# EAGLE design board (EAGLE 9.5.2)
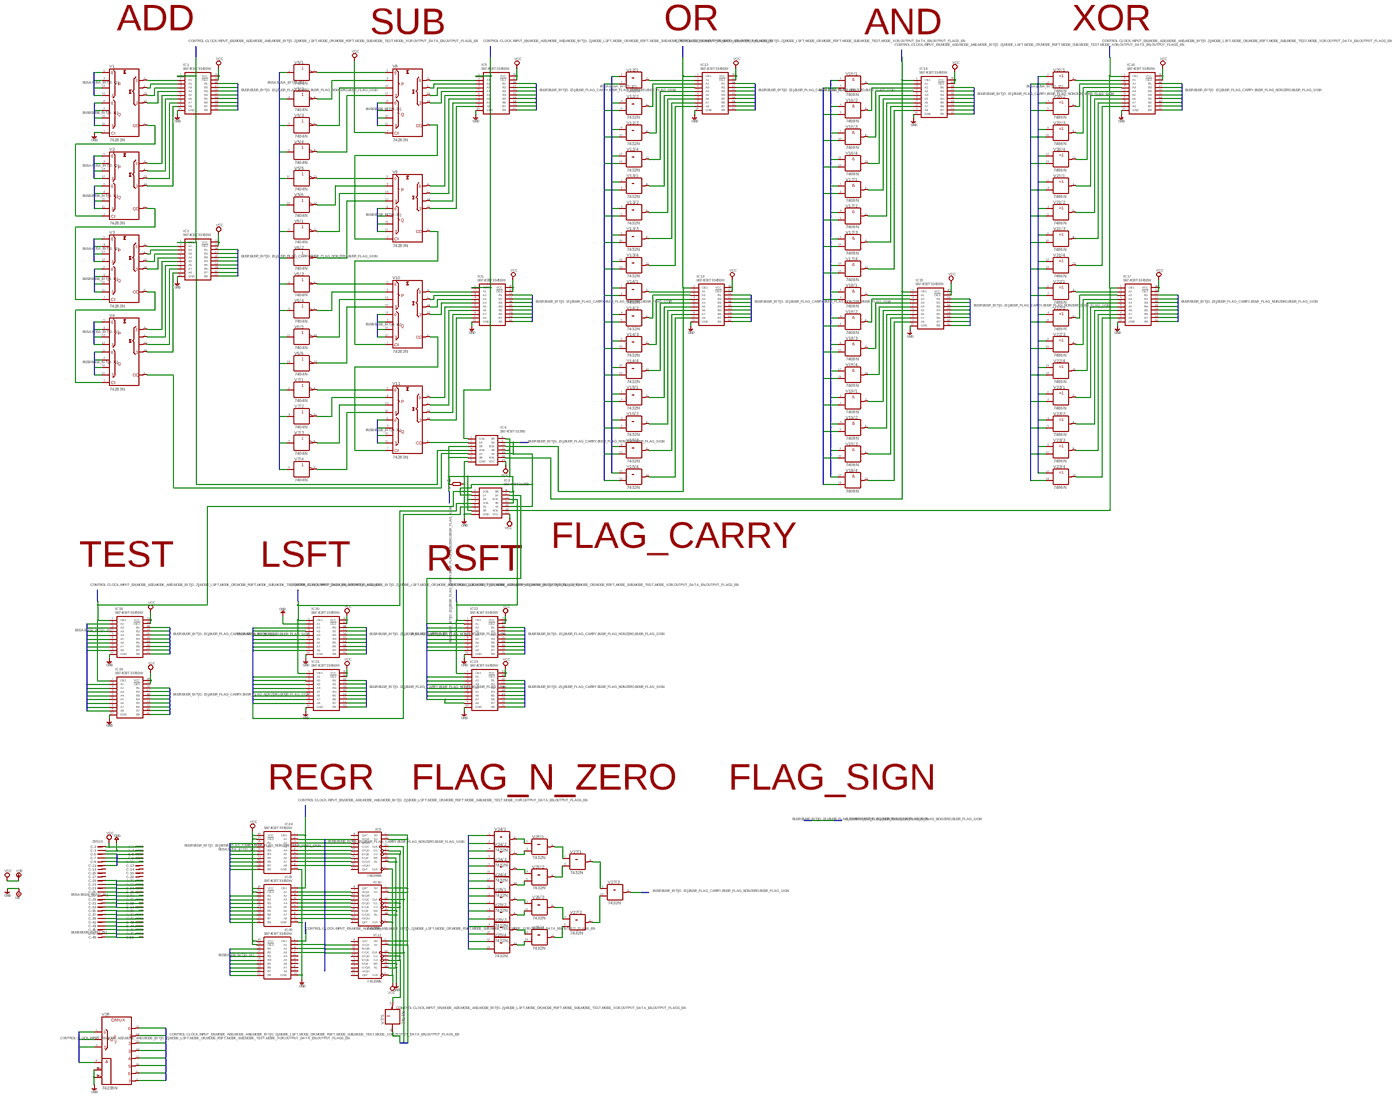
[diagram p0: schematic, sheet 1, overview]
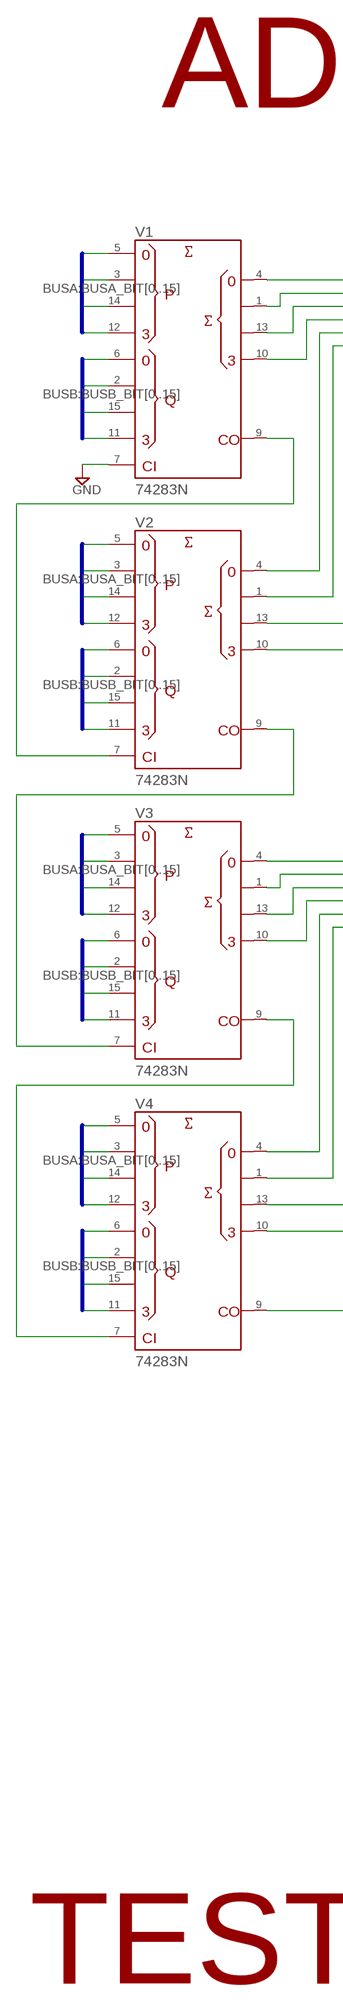
[diagram p1: schematic, sheet 1, part 1 of 6]
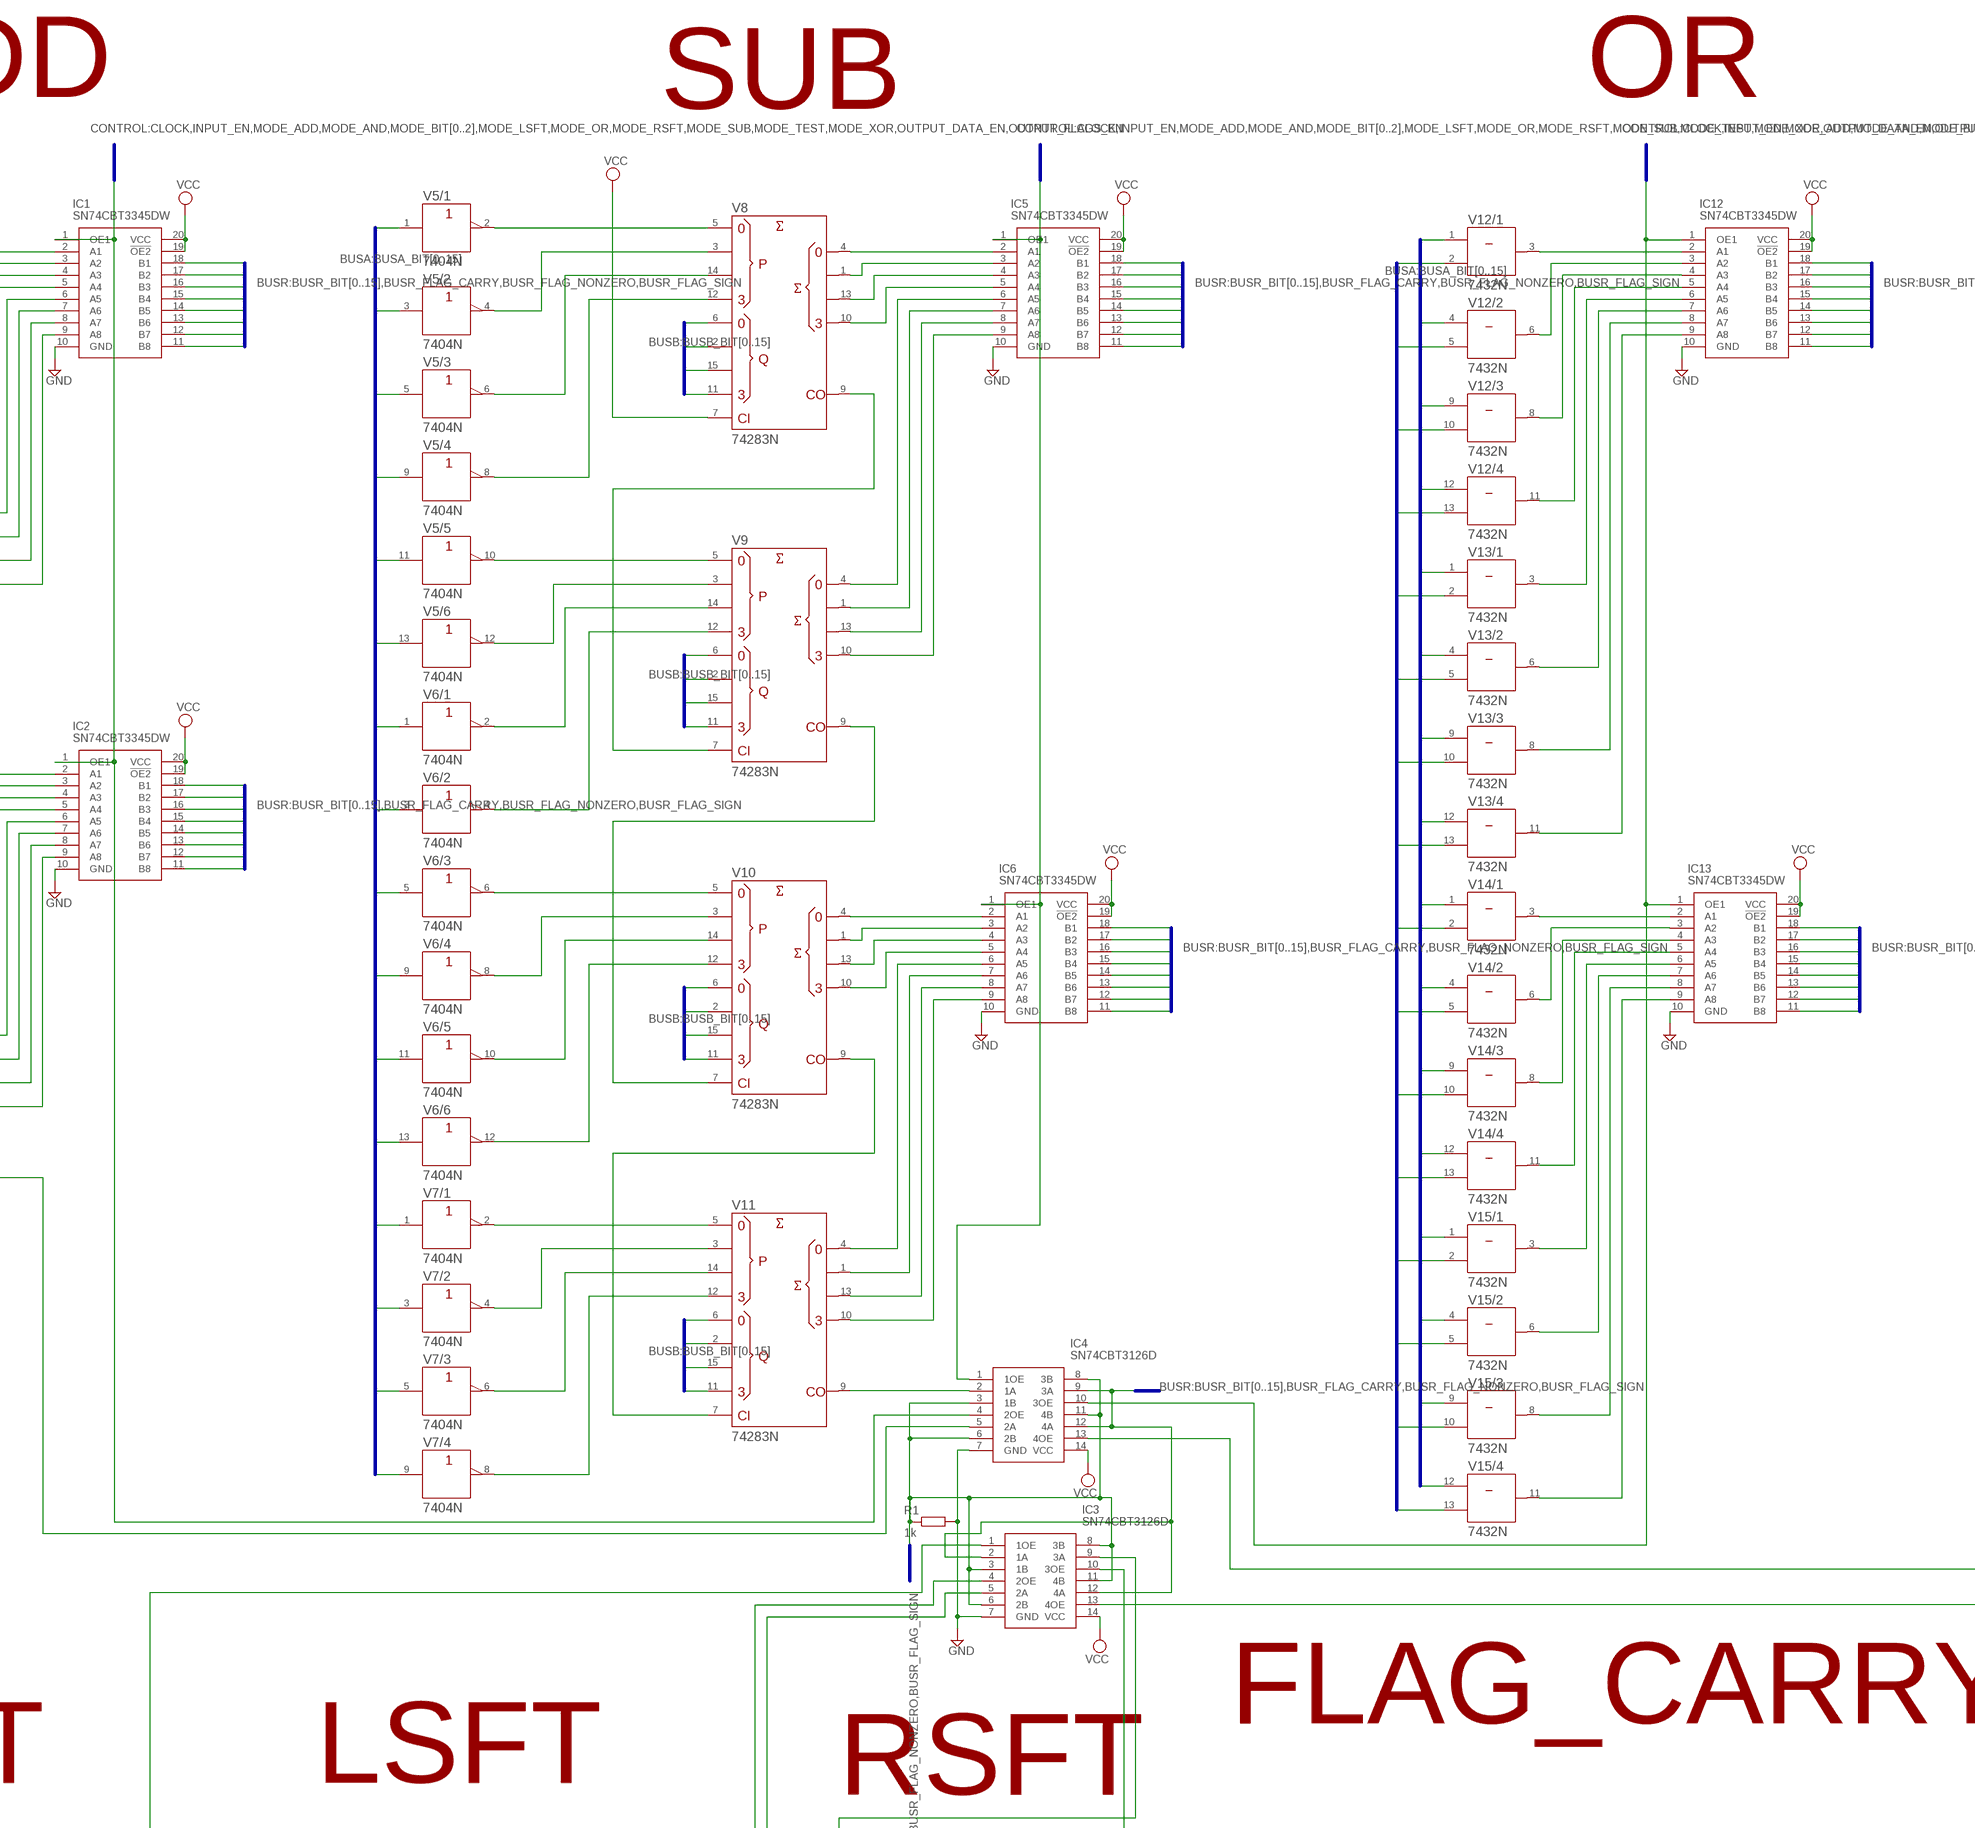
[diagram p2: schematic, sheet 1, part 2 of 6]
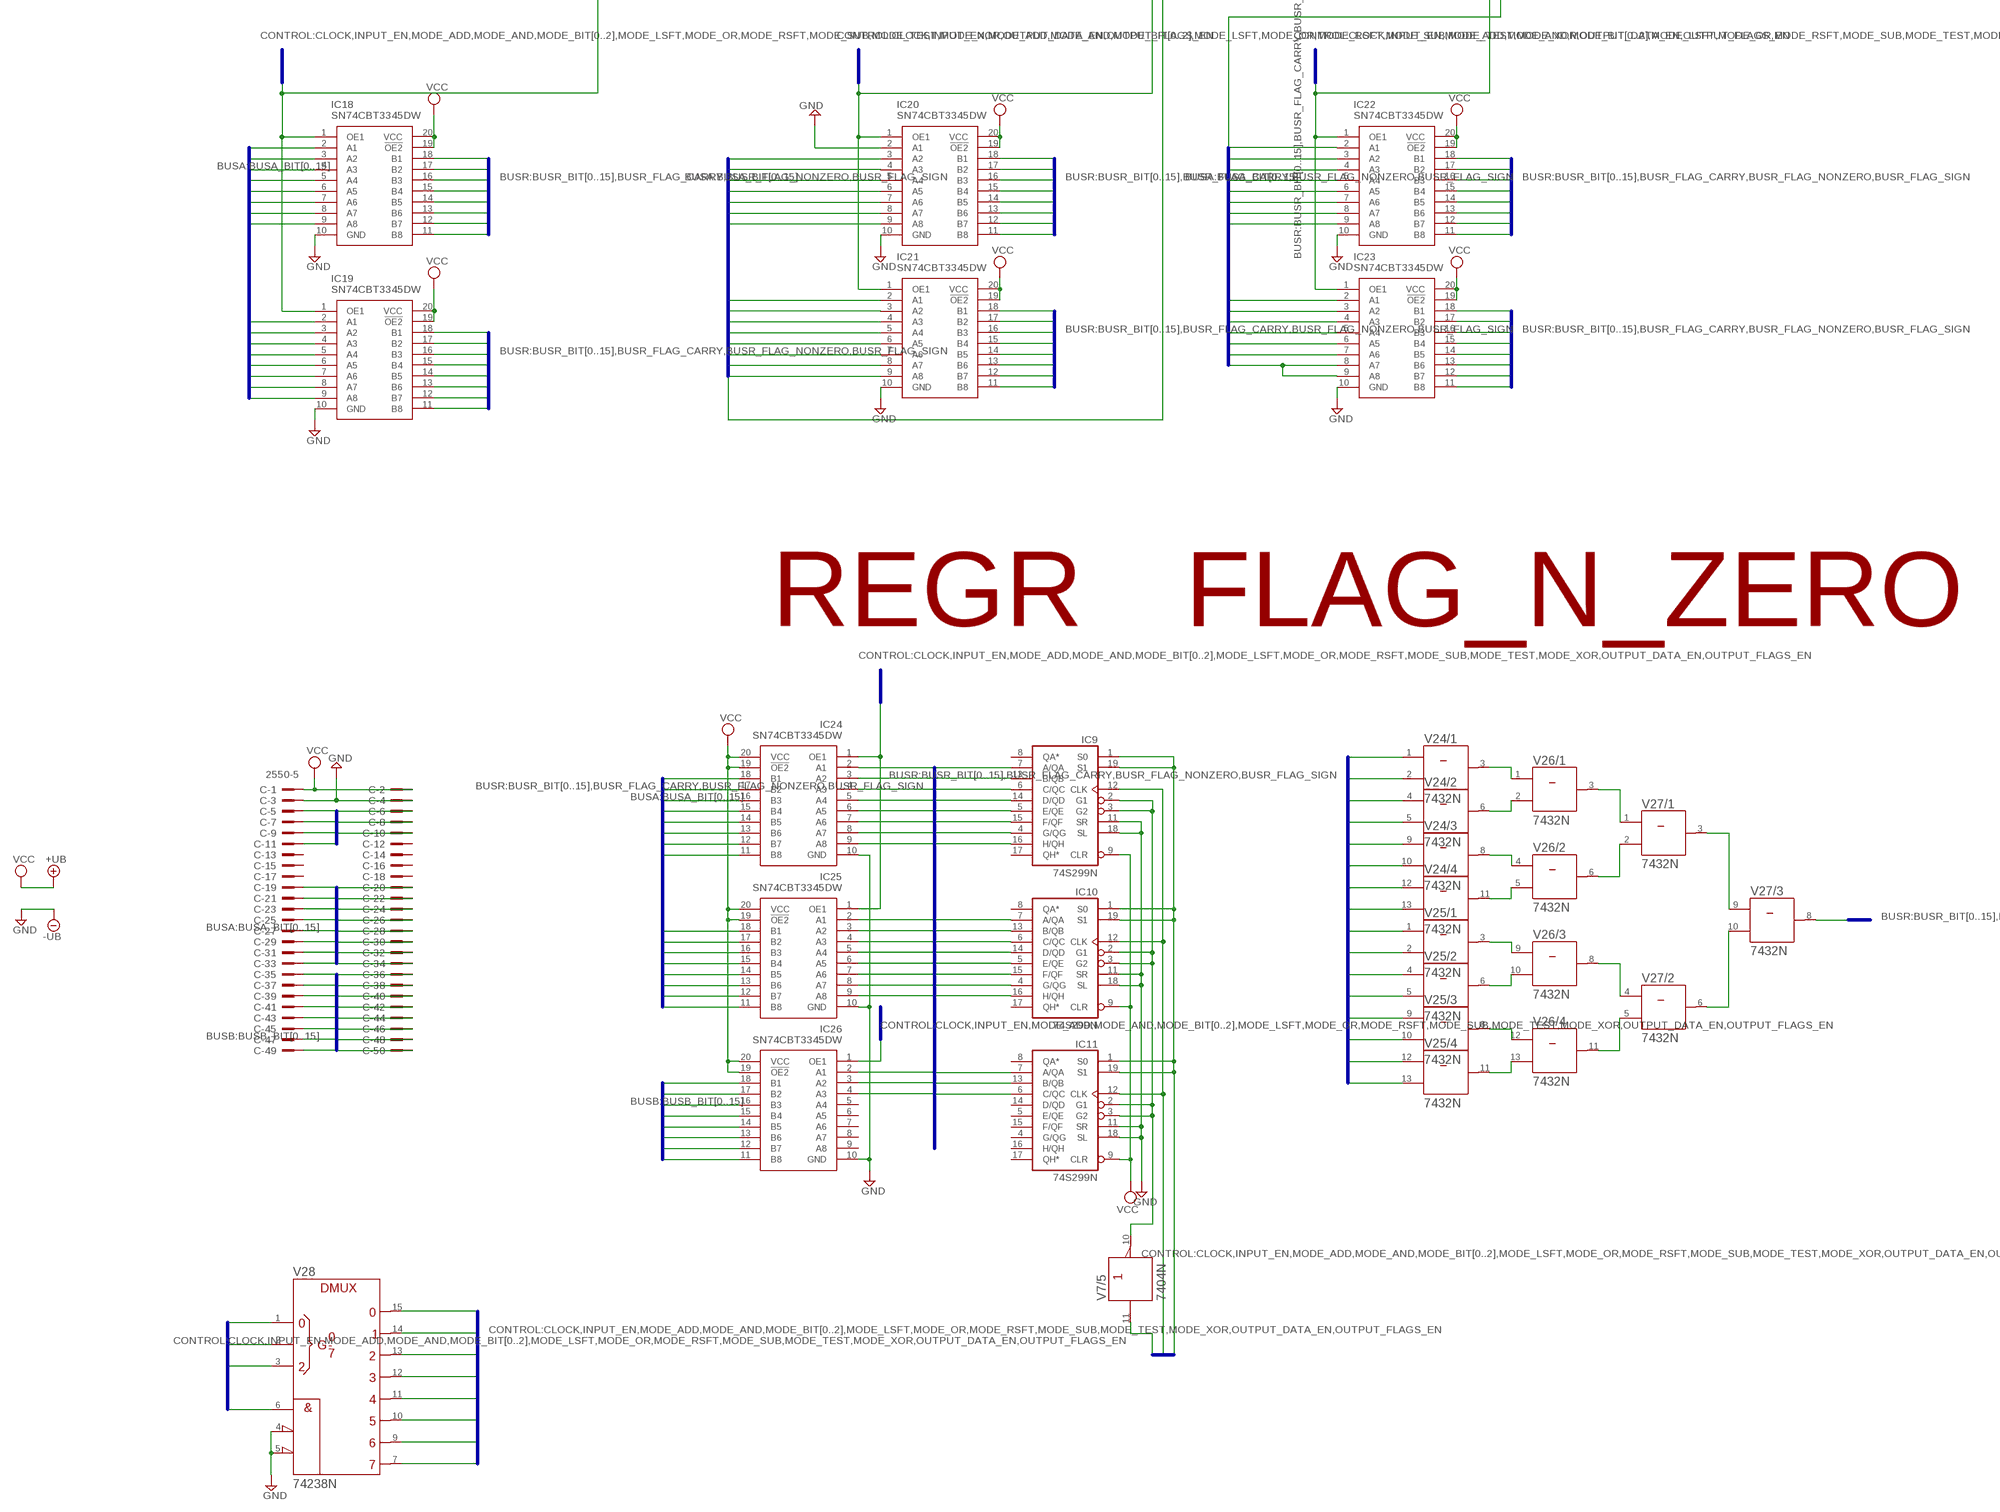
[diagram p3: schematic, sheet 1, part 3 of 6]
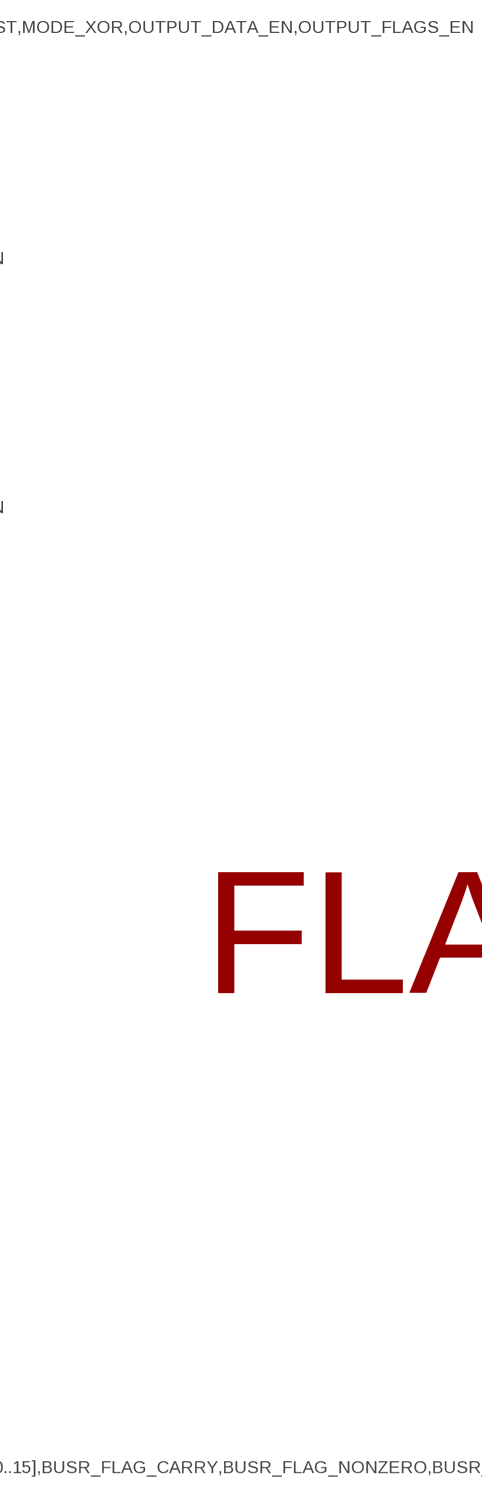
[diagram p4: schematic, sheet 1, part 4 of 6]
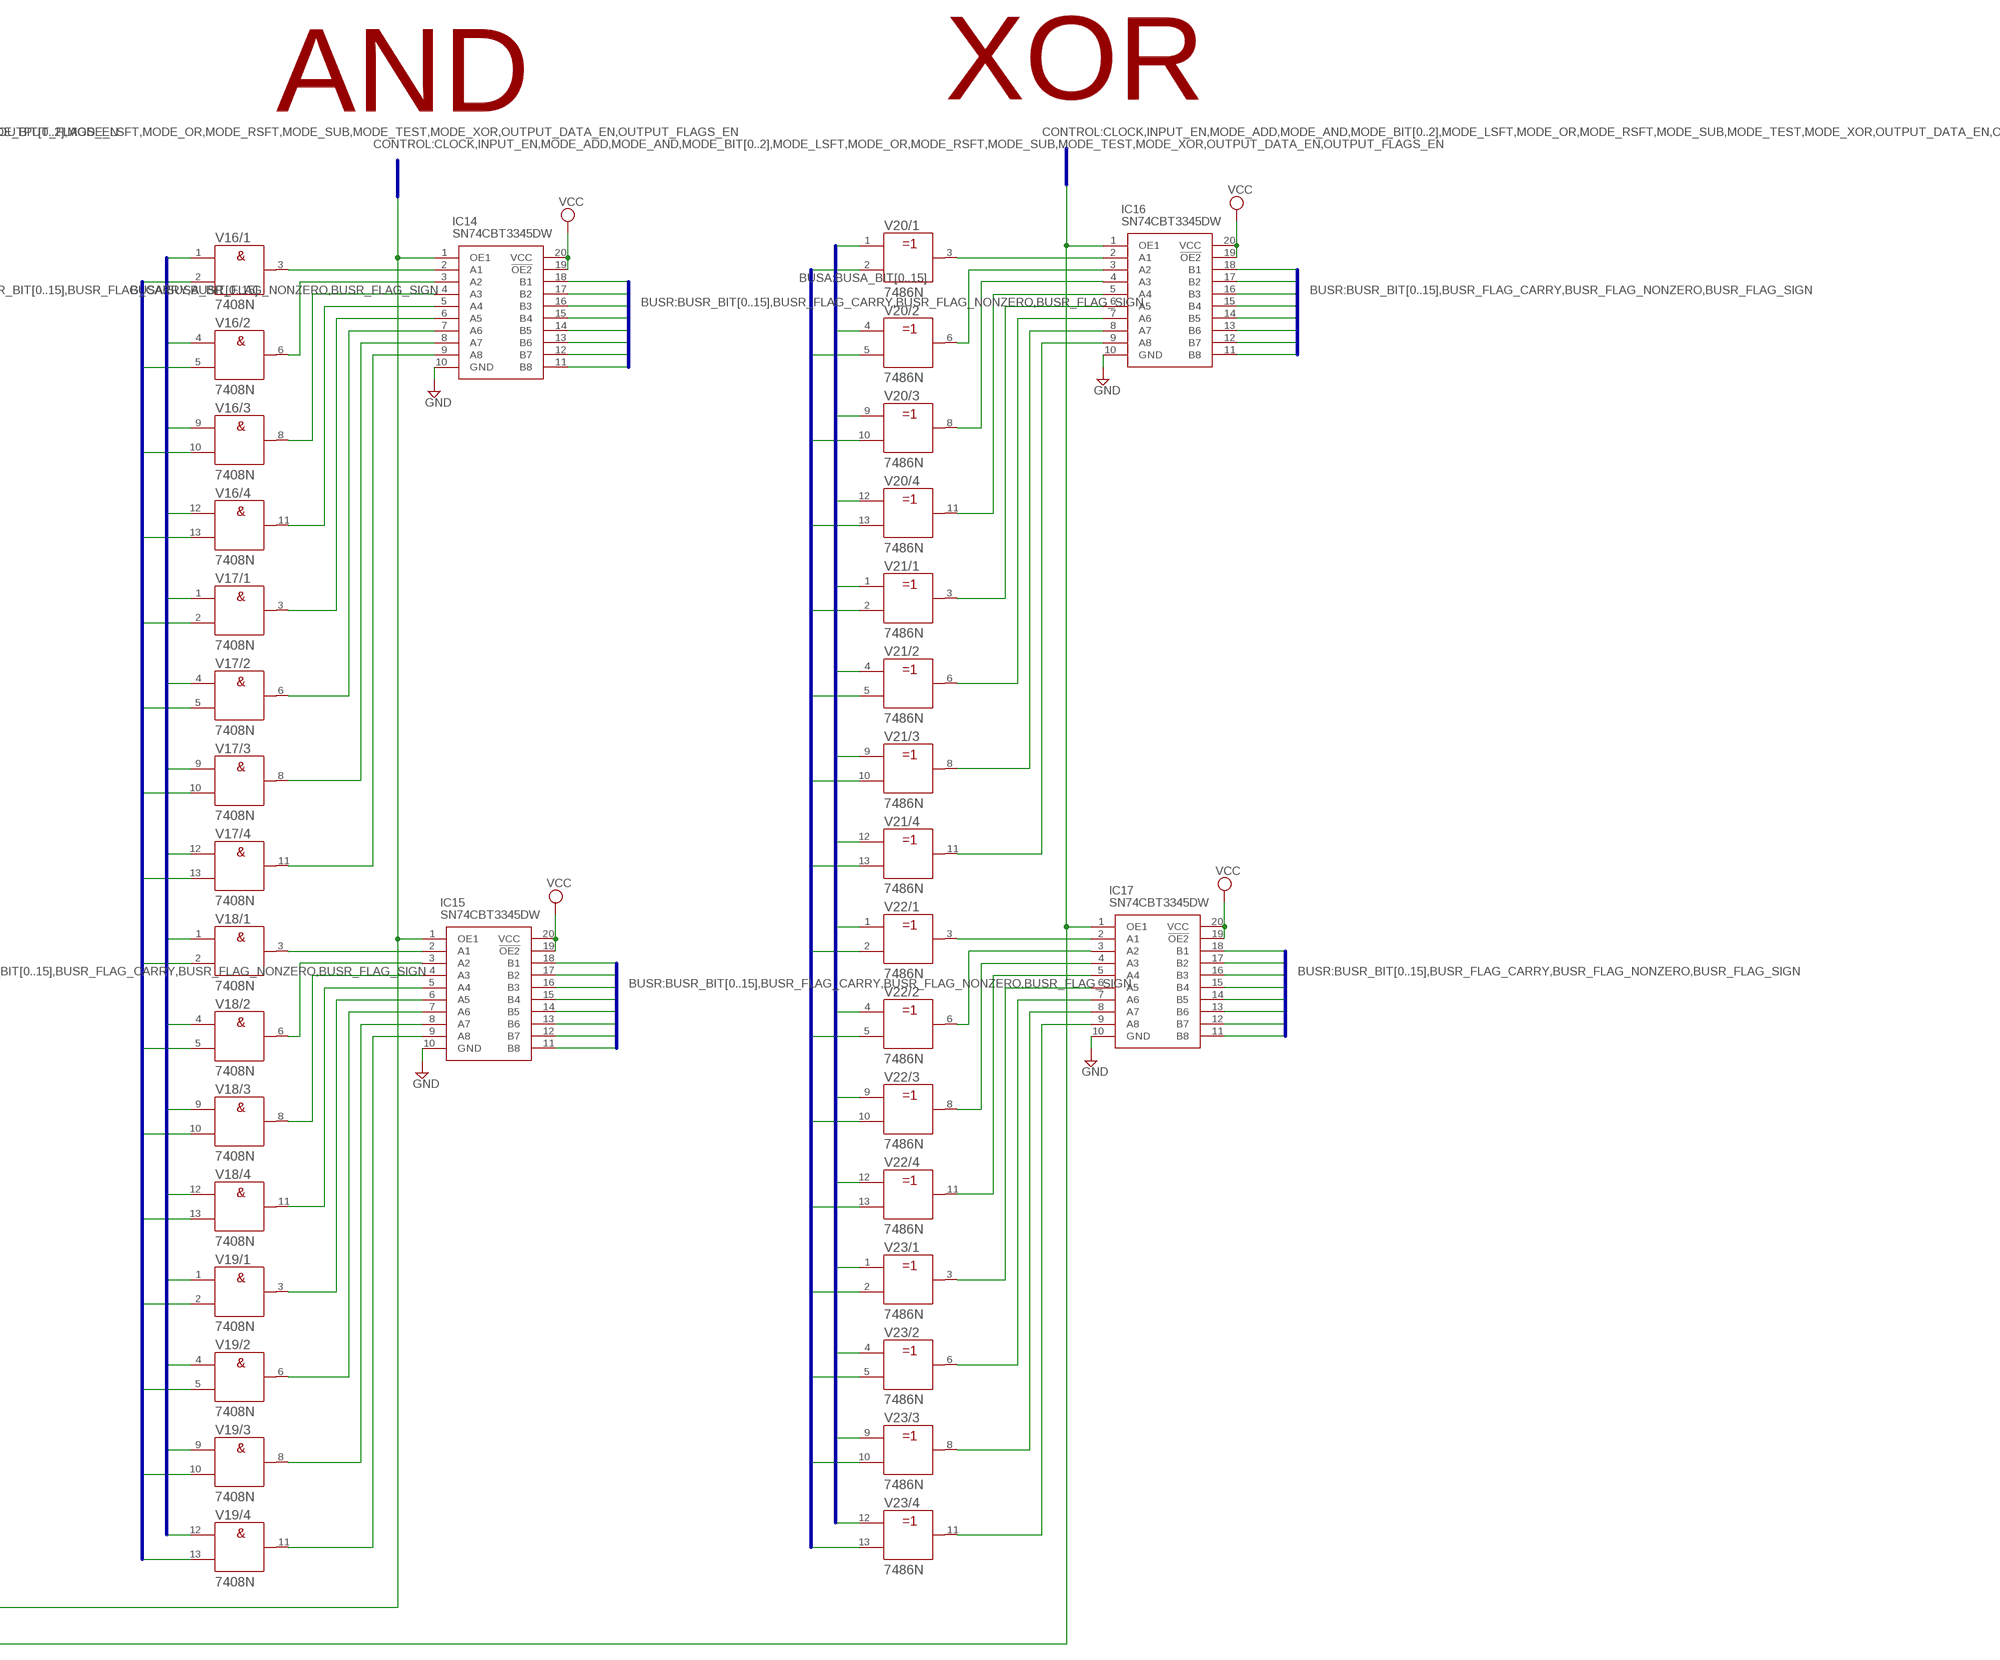
[diagram p5: schematic, sheet 1, part 5 of 6]
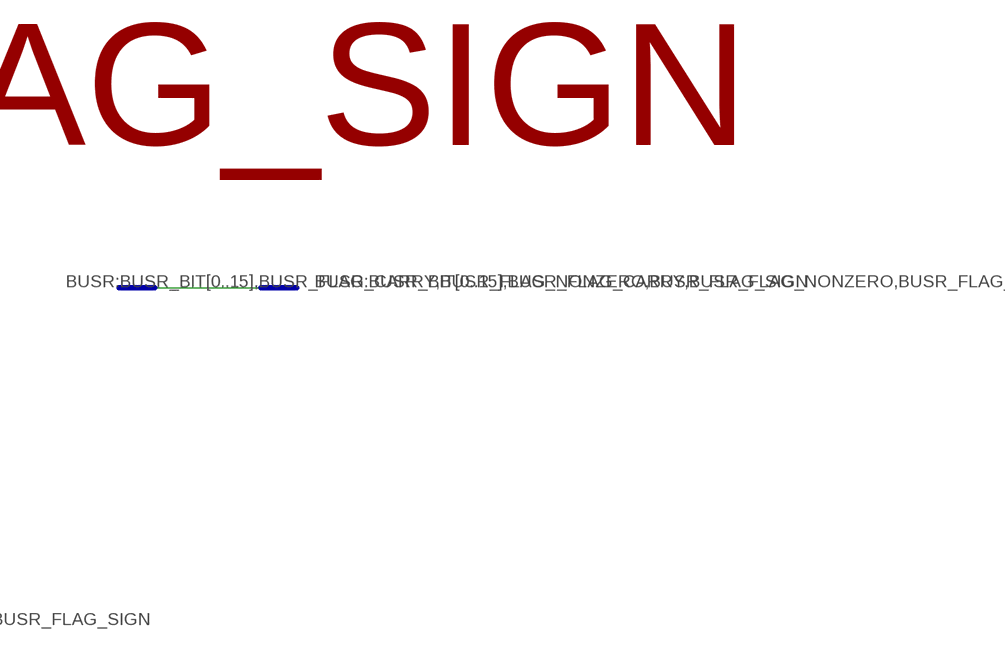
[diagram p6: schematic, sheet 1, part 6 of 6]

## Parts
C  2550-5  [PAK100/2500-5-50]
IC1  SN74CBT3345DW  [SOIC127P1030X265-20N]
IC2  SN74CBT3345DW  [SOIC127P1030X265-20N]
IC3  SN74CBT3126D  [SOIC127P600X175-14N]
IC4  SN74CBT3126D  [SOIC127P600X175-14N]
IC5  SN74CBT3345DW  [SOIC127P1030X265-20N]
IC6  SN74CBT3345DW  [SOIC127P1030X265-20N]
IC9  74S299N  [DIL20]
IC10  74S299N  [DIL20]
IC11  74S299N  [DIL20]
IC12  SN74CBT3345DW  [SOIC127P1030X265-20N]
IC13  SN74CBT3345DW  [SOIC127P1030X265-20N]
IC14  SN74CBT3345DW  [SOIC127P1030X265-20N]
IC15  SN74CBT3345DW  [SOIC127P1030X265-20N]
IC16  SN74CBT3345DW  [SOIC127P1030X265-20N]
IC17  SN74CBT3345DW  [SOIC127P1030X265-20N]
IC18  SN74CBT3345DW  [SOIC127P1030X265-20N]
IC19  SN74CBT3345DW  [SOIC127P1030X265-20N]
IC20  SN74CBT3345DW  [SOIC127P1030X265-20N]
IC21  SN74CBT3345DW  [SOIC127P1030X265-20N]
IC22  SN74CBT3345DW  [SOIC127P1030X265-20N]
IC23  SN74CBT3345DW  [SOIC127P1030X265-20N]
IC24  SN74CBT3345DW  [SOIC127P1030X265-20N]
IC25  SN74CBT3345DW  [SOIC127P1030X265-20N]
IC26  SN74CBT3345DW  [SOIC127P1030X265-20N]
R1  1k  R-EU_0207/10  [0207/10]
V1  74283N  [DIL16]
V2  74283N  [DIL16]
V3  74283N  [DIL16]
V4  74283N  [DIL16]
V5  7404N  [DIL14]
V6  7404N  [DIL14]
V7  7404N  [DIL14]
V8  74283N  [DIL16]
V9  74283N  [DIL16]
V10  74283N  [DIL16]
V11  74283N  [DIL16]
V12  7432N  [DIL14]
V13  7432N  [DIL14]
V14  7432N  [DIL14]
V15  7432N  [DIL14]
V16  7408N  [DIL14]
V17  7408N  [DIL14]
V18  7408N  [DIL14]
V19  7408N  [DIL14]
V20  7486N  [DIL14]
V21  7486N  [DIL14]
V22  7486N  [DIL14]
V23  7486N  [DIL14]
V24  7432N  [DIL14]
V25  7432N  [DIL14]
V26  7432N  [DIL14]
V27  7432N  [DIL14]
V28  74238N  [DIL16]

## Nets
BUSA_BIT0: C.19 IC3.9(3A) IC18.2(A1) IC20.3(A2) IC24.18(B1) V1.5(A1) V5.1(/1:A) V12.1(/1:A) V16.1(/1:A) V20.1(/1:A)
BUSA_BIT1: C.20 IC18.3(A2) IC20.4(A3) IC22.2(A1) IC24.17(B2) V1.3(A2) V5.3(/2:A) V12.4(/2:A) V16.4(/2:A) V20.4(/2:A)
BUSA_BIT2: C.21 IC18.4(A3) IC20.5(A4) IC22.3(A2) IC24.16(B3) V1.14(A3) V5.5(/3:A) V12.9(/3:A) V16.9(/3:A) V20.9(/3:A)
BUSA_BIT3: C.22 IC18.5(A4) IC20.6(A5) IC22.4(A3) IC24.15(B4) V1.12(A4) V5.9(/4:A) V12.12(/4:A) V16.12(/4:A) V20.12(/4:A)
BUSA_BIT4: C.23 IC18.6(A5) IC20.7(A6) IC22.5(A4) IC24.14(B5) V2.5(A1) V5.11(/5:A) V13.1(/1:A) V17.1(/1:A) V21.1(/1:A)
BUSA_BIT5: C.24 IC18.7(A6) IC20.8(A7) IC22.6(A5) IC24.13(B6) V2.3(A2) V5.13(/6:A) V13.4(/2:A) V17.4(/2:A) V21.4(/2:A)
BUSA_BIT6: C.25 IC18.8(A7) IC20.9(A8) IC22.7(A6) IC24.12(B7) V2.14(A3) V6.1(/1:A) V13.9(/3:A) V17.9(/3:A) V21.9(/3:A)
BUSA_BIT7: C.26 IC18.9(A8) IC21.2(A1) IC22.8(A7) IC24.11(B8) V2.12(A4) V6.3(/2:A) V13.12(/4:A) V17.12(/4:A) V21.12(/4:A)
BUSA_BIT8: C.27 IC19.2(A1) IC21.3(A2) IC22.9(A8) IC25.18(B1) V3.5(A1) V6.5(/3:A) V14.1(/1:A) V18.1(/1:A) V22.1(/1:A)
BUSA_BIT9: C.28 IC19.3(A2) IC21.4(A3) IC23.2(A1) IC25.17(B2) V3.3(A2) V6.9(/4:A) V14.4(/2:A) V18.4(/2:A) V22.4(/2:A)
BUSA_BIT10: C.29 IC19.4(A3) IC21.5(A4) IC23.3(A2) IC25.16(B3) V3.14(A3) V6.11(/5:A) V14.9(/3:A) V18.9(/3:A) V22.9(/3:A)
BUSA_BIT11: C.30 IC19.5(A4) IC21.6(A5) IC23.4(A3) IC25.15(B4) V3.12(A4) V6.13(/6:A) V14.12(/4:A) V18.12(/4:A) V22.12(/4:A)
BUSA_BIT12: C.31 IC19.6(A5) IC21.7(A6) IC23.5(A4) IC25.14(B5) V4.5(A1) V7.1(/1:A) V15.1(/1:A) V19.1(/1:A) V23.1(/1:A)
BUSA_BIT13: C.32 IC19.7(A6) IC21.8(A7) IC23.6(A5) IC25.13(B6) V4.3(A2) V7.3(/2:A) V15.4(/2:A) V19.4(/2:A) V23.4(/2:A)
BUSA_BIT14: C.33 IC19.8(A7) IC21.9(A8) IC23.7(A6) IC25.12(B7) V4.14(A3) V7.5(/3:A) V15.9(/3:A) V19.9(/3:A) V23.9(/3:A)
BUSA_BIT15: C.34 IC3.5(2A) IC19.9(A8) IC23.8(A7) IC23.9(A8) IC25.11(B8) V4.12(A4) V7.9(/4:A) V15.12(/4:A) V19.12(/4:A) V23.12(/4:A)
BUSB_BIT0: C.35 IC26.18(B1) V1.6(B1) V8.6(B1) V12.2(/1:B) V16.2(/1:B) V20.2(/1:B)
BUSB_BIT1: C.36 IC26.17(B2) V1.2(B2) V8.2(B2) V12.5(/2:B) V16.5(/2:B) V20.5(/2:B)
BUSB_BIT2: C.37 IC26.16(B3) V1.15(B3) V8.15(B3) V12.10(/3:B) V16.10(/3:B) V20.10(/3:B)
BUSB_BIT3: C.38 IC26.15(B4) V1.11(B4) V8.11(B4) V12.13(/4:B) V16.13(/4:B) V20.13(/4:B)
BUSB_BIT4: C.39 IC26.14(B5) V2.6(B1) V9.6(B1) V13.2(/1:B) V17.2(/1:B) V21.2(/1:B)
BUSB_BIT5: C.40 IC26.13(B6) V2.2(B2) V9.2(B2) V13.5(/2:B) V17.5(/2:B) V21.5(/2:B)
BUSB_BIT6: C.41 IC26.12(B7) V2.15(B3) V9.15(B3) V13.10(/3:B) V17.10(/3:B) V21.10(/3:B)
BUSB_BIT7: C.42 IC26.11(B8) V2.11(B4) V9.11(B4) V13.13(/4:B) V17.13(/4:B) V21.13(/4:B)
BUSB_BIT8: C.43 V3.6(B1) V10.6(B1) V14.2(/1:B) V18.2(/1:B) V22.2(/1:B)
BUSB_BIT9: C.44 V3.2(B2) V10.2(B2) V14.5(/2:B) V18.5(/2:B) V22.5(/2:B)
BUSB_BIT10: C.45 V3.15(B3) V10.15(B3) V14.10(/3:B) V18.10(/3:B) V22.10(/3:B)
BUSB_BIT11: C.46 V3.11(B4) V10.11(B4) V14.13(/4:B) V18.13(/4:B) V22.13(/4:B)
BUSB_BIT12: C.47 V4.6(B1) V11.6(B1) V15.2(/1:B) V19.2(/1:B) V23.2(/1:B)
BUSB_BIT13: C.48 V4.2(B2) V11.2(B2) V15.5(/2:B) V19.5(/2:B) V23.5(/2:B)
BUSB_BIT14: C.49 V4.15(B3) V11.15(B3) V15.10(/3:B) V19.10(/3:B) V23.10(/3:B)
BUSB_BIT15: C.50 V4.11(B4) V11.11(B4) V15.13(/4:B) V19.13(/4:B) V23.13(/4:B)
BUSR_BIT0: IC1.18(B1) IC3.2(1A) IC3.12(4A) IC4.9(3A) IC4.12(4A) IC5.18(B1) IC9.7(A/QA) IC12.18(B1) IC14.18(B1) IC16.18(B1) IC18.18(B1) IC20.18(B1) IC22.18(B1) IC24.2(A1) V24.1(/1:A)
BUSR_BIT1: IC1.17(B2) IC5.17(B2) IC9.13(B/QB) IC12.17(B2) IC14.17(B2) IC16.17(B2) IC18.17(B2) IC20.17(B2) IC22.17(B2) IC24.3(A2) V24.2(/1:B)
BUSR_BIT2: IC1.16(B3) IC5.16(B3) IC9.6(C/QC) IC12.16(B3) IC14.16(B3) IC16.16(B3) IC18.16(B3) IC20.16(B3) IC22.16(B3) IC24.4(A3) V24.4(/2:A)
BUSR_BIT3: IC1.15(B4) IC5.15(B4) IC9.14(D/QD) IC12.15(B4) IC14.15(B4) IC16.15(B4) IC18.15(B4) IC20.15(B4) IC22.15(B4) IC24.5(A4) V24.5(/2:B)
BUSR_BIT4: IC1.14(B5) IC5.14(B5) IC9.5(E/QE) IC12.14(B5) IC14.14(B5) IC16.14(B5) IC18.14(B5) IC20.14(B5) IC22.14(B5) IC24.6(A5) V24.9(/3:A)
BUSR_BIT5: IC1.13(B6) IC5.13(B6) IC9.15(F/QF) IC12.13(B6) IC14.13(B6) IC16.13(B6) IC18.13(B6) IC20.13(B6) IC22.13(B6) IC24.7(A6) V24.10(/3:B)
BUSR_BIT6: IC1.12(B7) IC5.12(B7) IC9.4(G/QG) IC12.12(B7) IC14.12(B7) IC16.12(B7) IC18.12(B7) IC20.12(B7) IC22.12(B7) IC24.8(A7) V24.12(/4:A)
BUSR_BIT7: IC1.11(B8) IC5.11(B8) IC9.16(H/QH) IC12.11(B8) IC14.11(B8) IC16.11(B8) IC18.11(B8) IC20.11(B8) IC22.11(B8) IC24.9(A8) V24.13(/4:B)
BUSR_BIT8: IC2.18(B1) IC6.18(B1) IC10.7(A/QA) IC13.18(B1) IC15.18(B1) IC17.18(B1) IC19.18(B1) IC21.18(B1) IC23.18(B1) IC25.2(A1) V25.1(/1:A)
BUSR_BIT9: IC2.17(B2) IC6.17(B2) IC10.13(B/QB) IC13.17(B2) IC15.17(B2) IC17.17(B2) IC19.17(B2) IC21.17(B2) IC23.17(B2) IC25.3(A2) V25.2(/1:B)
BUSR_BIT10: IC2.16(B3) IC6.16(B3) IC10.6(C/QC) IC13.16(B3) IC15.16(B3) IC17.16(B3) IC19.16(B3) IC21.16(B3) IC23.16(B3) IC25.4(A3) V25.4(/2:A)
BUSR_BIT11: IC2.15(B4) IC6.15(B4) IC10.14(D/QD) IC13.15(B4) IC15.15(B4) IC17.15(B4) IC19.15(B4) IC21.15(B4) IC23.15(B4) IC25.5(A4) V25.5(/2:B)
BUSR_BIT12: IC2.14(B5) IC6.14(B5) IC10.5(E/QE) IC13.14(B5) IC15.14(B5) IC17.14(B5) IC19.14(B5) IC21.14(B5) IC23.14(B5) IC25.6(A5) V25.9(/3:A)
BUSR_BIT13: IC2.13(B6) IC6.13(B6) IC10.15(F/QF) IC13.13(B6) IC15.13(B6) IC17.13(B6) IC19.13(B6) IC21.13(B6) IC23.13(B6) IC25.7(A6) V25.10(/3:B)
BUSR_BIT14: IC2.12(B7) IC6.12(B7) IC10.4(G/QG) IC13.12(B7) IC15.12(B7) IC17.12(B7) IC19.12(B7) IC21.12(B7) IC23.12(B7) IC25.8(A7) V25.12(/4:A)
BUSR_BIT15: IC2.11(B8) IC6.11(B8) IC10.16(H/QH) IC13.11(B8) IC15.11(B8) IC17.11(B8) IC19.11(B8) IC21.11(B8) IC23.11(B8) IC25.9(A8) V25.13(/4:B)
BUSR_FLAG_CARRY: IC3.3(1B) IC3.6(2B) IC3.8(3B) IC3.11(4B) IC4.3(1B) IC4.6(2B) IC4.8(3B) IC4.11(4B) IC11.7(A/QA) IC26.2(A1) R1.1
BUSR_FLAG_NONZERO: IC11.13(B/QB) IC26.3(A2) V27.8(/3:Y)
BUSR_FLAG_SIGN: IC11.6(C/QC) IC26.4(A3)
CLOCK: C.5 IC9.12(CLK) IC10.12(CLK) IC11.12(CLK)
GND: C.3 C.4 IC1.10(GND) IC2.10(GND) IC3.7(GND) IC4.7(GND) IC5.10(GND) IC6.10(GND) IC9.11(SR) IC9.18(SL) IC10.11(SR) IC10.18(SL) IC11.11(SR) IC11.18(SL) IC12.10(GND) IC13.10(GND) IC14.10(GND) IC15.10(GND) IC16.10(GND) IC17.10(GND) IC18.10(GND) IC19.10(GND) IC20.2(A1) IC20.10(GND) IC21.10(GND) IC22.10(GND) IC23.10(GND) IC24.10(GND) IC25.10(GND) IC26.10(GND) R1.2 V1.7(C0) V28.4(!G2A) V28.5(!G2B) ; supply symbol labelled -UB
INPUT_EN: C.7 IC9.1(S0) IC9.19(S1) IC10.1(S0) IC10.19(S1) IC11.1(S0) IC11.19(S1) V28.6(G1)
MODE_ADD: IC1.1(OE1) IC2.1(OE1) IC4.4(2OE) V28.15(Y0)
MODE_AND: IC4.13(4OE) IC14.1(OE1) IC15.1(OE1) V28.13(Y2)
MODE_BIT0: C.6 V28.1(A)
MODE_BIT1: C.8 V28.2(B)
MODE_BIT2: C.10 V28.3(C)
MODE_LSFT: IC3.4(2OE) IC20.1(OE1) IC21.1(OE1) V28.10(Y5)
MODE_OR: IC4.10(3OE) IC12.1(OE1) IC13.1(OE1) V28.12(Y3)
MODE_RSFT: IC3.10(3OE) IC22.1(OE1) IC23.1(OE1) V28.9(Y6)
MODE_SUB: IC4.1(1OE) IC5.1(OE1) IC6.1(OE1) V28.14(Y1)
MODE_TEST: IC3.1(1OE) IC18.1(OE1) IC19.1(OE1) V28.7(Y7)
MODE_XOR: IC3.13(4OE) IC16.1(OE1) IC17.1(OE1) V28.11(Y4)
N$1: V1.9(C4) V2.7(C0)
N$2: V2.9(C4) V3.7(C0)
N$3: V3.9(C4) V4.7(C0)
N$4: V8.9(C4) V9.7(C0)
N$5: V9.9(C4) V10.7(C0)
N$6: V10.9(C4) V11.7(C0)
N$7: V5.2(/1:Y) V8.5(A1)
N$8: V5.4(/2:Y) V8.3(A2)
N$9: V5.6(/3:Y) V8.14(A3)
N$10: V5.8(/4:Y) V8.12(A4)
N$11: V5.10(/5:Y) V9.5(A1)
N$12: V5.12(/6:Y) V9.3(A2)
N$13: V6.2(/1:Y) V9.14(A3)
N$14: V6.4(/2:Y) V9.12(A4)
N$15: V6.6(/3:Y) V10.5(A1)
N$16: V6.8(/4:Y) V10.3(A2)
N$17: V6.10(/5:Y) V10.14(A3)
N$18: V6.12(/6:Y) V10.12(A4)
N$19: V7.2(/1:Y) V11.5(A1)
N$20: V7.4(/2:Y) V11.3(A2)
N$21: V7.6(/3:Y) V11.14(A3)
N$22: V7.8(/4:Y) V11.12(A4)
N$23: IC1.2(A1) V1.4(S1)
N$24: IC1.3(A2) V1.1(S2)
N$25: IC1.4(A3) V1.13(S3)
N$26: IC1.5(A4) V1.10(S4)
N$27: IC1.6(A5) V2.4(S1)
N$28: IC1.7(A6) V2.1(S2)
N$29: IC1.8(A7) V2.13(S3)
N$30: IC1.9(A8) V2.10(S4)
N$31: IC2.2(A1) V3.4(S1)
N$32: IC2.3(A2) V3.1(S2)
N$33: IC2.4(A3) V3.13(S3)
N$34: IC2.5(A4) V3.10(S4)
N$35: IC2.6(A5) V4.4(S1)
N$36: IC2.7(A6) V4.1(S2)
N$37: IC2.8(A7) V4.13(S3)
N$38: IC2.9(A8) V4.10(S4)
N$39: IC5.2(A1) V8.4(S1)
N$40: IC5.3(A2) V8.1(S2)
N$41: IC5.4(A3) V8.13(S3)
N$42: IC5.5(A4) V8.10(S4)
N$43: IC5.6(A5) V9.4(S1)
N$44: IC5.7(A6) V9.1(S2)
N$45: IC5.8(A7) V9.13(S3)
N$46: IC5.9(A8) V9.10(S4)
N$47: IC6.2(A1) V10.4(S1)
N$48: IC6.3(A2) V10.1(S2)
N$49: IC4.5(2A) V4.9(C4)
N$50: IC6.5(A4) V10.10(S4)
N$51: IC6.6(A5) V11.4(S1)
N$52: IC6.7(A6) V11.1(S2)
N$53: IC6.8(A7) V11.13(S3)
N$54: IC6.9(A8) V11.10(S4)
N$55: IC13.8(A7) V15.8(/3:Y)
N$56: IC6.4(A3) V10.13(S3)
N$57: IC4.2(1A) V11.9(C4)
N$58: IC14.2(A1) V16.3(/1:Y)
N$66: V24.3(/1:Y) V26.1(/1:A)
N$67: IC14.3(A2) V16.6(/2:Y)
N$68: IC12.2(A1) V12.3(/1:Y)
N$70: IC9.2(G1) IC9.3(G2) IC10.2(G1) IC10.3(G2) IC11.2(G1) IC11.3(G2) V7.10(/5:Y)
N$72: IC12.3(A2) V12.6(/2:Y)
N$74: IC14.5(A4) V16.11(/4:Y)
N$75: IC12.5(A4) V12.11(/4:Y)
N$77: IC12.6(A5) V13.3(/1:Y)
N$78: IC12.7(A6) V13.6(/2:Y)
N$79: IC14.6(A5) V17.3(/1:Y)
N$80: IC12.9(A8) V13.11(/4:Y)
N$81: IC13.2(A1) V14.3(/1:Y)
N$82: IC14.7(A6) V17.6(/2:Y)
N$83: IC13.4(A3) V14.8(/3:Y)
N$84: IC13.5(A4) V14.11(/4:Y)
N$85: IC13.6(A5) V15.3(/1:Y)
N$86: IC14.9(A8) V17.11(/4:Y)
N$87: IC15.2(A1) V18.3(/1:Y)
N$88: IC15.4(A3) V18.8(/3:Y)
N$89: IC15.5(A4) V18.11(/4:Y)
N$90: IC15.6(A5) V19.3(/1:Y)
N$91: IC12.4(A3) V12.8(/3:Y)
N$92: IC14.4(A3) V16.8(/3:Y)
N$93: IC14.8(A7) V17.8(/3:Y)
N$94: IC15.3(A2) V18.6(/2:Y)
N$95: IC12.8(A7) V13.8(/3:Y)
N$96: IC15.7(A6) V19.6(/2:Y)
N$97: IC15.9(A8) V19.11(/4:Y)
N$98: IC13.3(A2) V14.6(/2:Y)
N$99: IC15.8(A7) V19.8(/3:Y)
N$100: IC16.2(A1) V20.3(/1:Y)
N$101: IC13.7(A6) V15.6(/2:Y)
N$102: IC16.3(A2) V20.6(/2:Y)
N$103: IC13.9(A8) V15.11(/4:Y)
N$104: IC16.5(A4) V20.11(/4:Y)
N$105: IC16.6(A5) V21.3(/1:Y)
N$106: IC16.7(A6) V21.6(/2:Y)
N$107: IC16.9(A8) V21.11(/4:Y)
N$108: IC17.2(A1) V22.3(/1:Y)
N$109: IC17.4(A3) V22.8(/3:Y)
N$110: IC17.5(A4) V22.11(/4:Y)
N$111: IC17.6(A5) V23.3(/1:Y)
N$112: IC16.4(A3) V20.8(/3:Y)
N$113: IC16.8(A7) V21.8(/3:Y)
N$114: IC17.3(A2) V22.6(/2:Y)
N$115: IC17.7(A6) V23.6(/2:Y)
N$116: IC17.9(A8) V23.11(/4:Y)
N$117: IC17.8(A7) V23.8(/3:Y)
N$118: V24.6(/2:Y) V26.2(/1:B)
N$119: V24.11(/4:Y) V26.5(/2:B)
N$120: V25.6(/2:Y) V26.10(/3:B)
N$121: V25.11(/4:Y) V26.13(/4:B)
N$122: V26.11(/4:Y) V27.5(/2:B)
N$123: V26.6(/2:Y) V27.2(/1:B)
N$124: V26.3(/1:Y) V27.1(/1:A)
N$125: V26.8(/3:Y) V27.4(/2:A)
N$126: V27.6(/2:Y) V27.10(/3:B)
N$127: V27.3(/1:Y) V27.9(/3:A)
N$128: V25.3(/1:Y) V26.9(/3:A)
N$129: V24.8(/3:Y) V26.4(/2:A)
N$130: V25.8(/3:Y) V26.12(/4:A)
OUTPUT_DATA_EN: C.9 IC24.1(OE1) IC25.1(OE1) V7.11(/5:A)
OUTPUT_FLAGS_EN: C.11 IC26.1(OE1)
VCC: C.1 C.2 IC1.19(!OE2) IC1.20(VCC) IC2.19(!OE2) IC2.20(VCC) IC3.14(VCC) IC4.14(VCC) IC5.19(!OE2) IC5.20(VCC) IC6.19(!OE2) IC6.20(VCC) IC9.9(CLR) IC10.9(CLR) IC11.9(CLR) IC12.19(!OE2) IC12.20(VCC) IC13.19(!OE2) IC13.20(VCC) IC14.19(!OE2) IC14.20(VCC) IC15.19(!OE2) IC15.20(VCC) IC16.19(!OE2) IC16.20(VCC) IC17.19(!OE2) IC17.20(VCC) IC18.19(!OE2) IC18.20(VCC) IC19.19(!OE2) IC19.20(VCC) IC20.19(!OE2) IC20.20(VCC) IC21.19(!OE2) IC21.20(VCC) IC22.19(!OE2) IC22.20(VCC) IC23.19(!OE2) IC23.20(VCC) IC24.19(!OE2) IC24.20(VCC) IC25.19(!OE2) IC25.20(VCC) IC26.19(!OE2) IC26.20(VCC) V8.7(C0) ; supply symbol labelled +UB
Unconnected: C.12 C.13 C.14 C.15 C.16 C.17 C.18 IC9.8(QA*) IC9.17(QH*) IC10.8(QA*) IC10.17(QH*) IC11.4(G/QG) IC11.5(E/QE) IC11.8(QA*) IC11.14(D/QD) IC11.15(F/QF) IC11.16(H/QH) IC11.17(QH*) IC26.5(A4) IC26.6(A5) IC26.7(A6) IC26.8(A7) IC26.9(A8) V7.12(/6:Y) V7.13(/6:A) V27.11(/4:Y) V27.12(/4:A) V27.13(/4:B)

## Buses
BUSA:BUSA_BIT[0..15]
BUSB:BUSB_BIT[0..15]
BUSR:BUSR_BIT[0..15],BUSR_FLAG_CARRY,BUSR_FLAG_NONZERO,BUSR_FLAG_SIGN
CONTROL:CLOCK,INPUT_EN,MODE_ADD,MODE_AND,MODE_BIT[0..2],MODE_LSFT,MODE_OR,MODE_RSFT,MODE_SUB,MODE_TEST,MODE_XOR,OUTPUT_DATA_EN,OUTPUT_FLAGS_EN

## Notes on the sheet
- ADD | SUB | OR | AND | XOR
- FLAG_CARRY
- TEST | LSFT | RSFT
- REGR | FLAG_N_ZERO | FLAG_SIGN

## Power pins joined to a net without a drawn wire
GND: IC9.10(GND) IC10.10(GND) IC11.10(GND) V1.8(-UB) V2.8(-UB) V3.8(-UB) V4.8(-UB) V5.7(/-UB:-UB) V6.7(/-UB:-UB) V7.7(/-UB:-UB) V8.8(-UB) V9.8(-UB) V10.8(-UB) V11.8(-UB) V12.7(/-UB:-UB) V13.7(/-UB:-UB) V14.7(/-UB:-UB) V15.7(/-UB:-UB) V16.7(/-UB:-UB) V17.7(/-UB:-UB) V18.7(/-UB:-UB) V19.7(/-UB:-UB) V20.7(/-UB:-UB) V21.7(/-UB:-UB) V22.7(/-UB:-UB) V23.7(/-UB:-UB) V24.7(/-UB:-UB) V25.7(/-UB:-UB) V26.7(/-UB:-UB) V27.7(/-UB:-UB) V28.8(-UB)
VCC: IC9.20(VCC) IC10.20(VCC) IC11.20(VCC) V1.16(+UB) V2.16(+UB) V3.16(+UB) V4.16(+UB) V5.14(/+UB:+UB) V6.14(/+UB:+UB) V7.14(/+UB:+UB) V8.16(+UB) V9.16(+UB) V10.16(+UB) V11.16(+UB) V12.14(/+UB:+UB) V13.14(/+UB:+UB) V14.14(/+UB:+UB) V15.14(/+UB:+UB) V16.14(/+UB:+UB) V17.14(/+UB:+UB) V18.14(/+UB:+UB) V19.14(/+UB:+UB) V20.14(/+UB:+UB) V21.14(/+UB:+UB) V22.14(/+UB:+UB) V23.14(/+UB:+UB) V24.14(/+UB:+UB) V25.14(/+UB:+UB) V26.14(/+UB:+UB) V27.14(/+UB:+UB) V28.16(+UB)

## Library data of the parts
C = con-3m:2550-: 3M (TM) Pak 100 4-Wall Header Source: 3M; OC_FARNELL: 1788696; OC_NEWARK: unknown
IC1 IC2 IC5 IC6 IC12-IC26 = SamacSys_Parts:SN74CBT3345DW: Texas Instruments SN74CBT3345DW, Bus Switch, 8 x 1:1, 4.5 5.5 V, 20-Pin SOIC Source: Datasheet <https://www.ti.com/lit/ds/symlink/sn74cbt3345.pdf>; DESCRIPTION: Texas Instruments SN74CBT3345DW, Bus Switch, 8 x 1:1, 4.5 5.5 V, 20-Pin SOIC; HEIGHT: 2.65mm; MANUFACTURER_NAME: Texas Instruments; MANUFACTURER_PART_NUMBER: SN74CBT3345DW
IC3 IC4 = SamacSys_Parts:SN74CBT3126D: Quadruple FET Bus Switch Source: Datasheet <http://www.ti.com/lit/gpn/SN74CBT3126>; DESCRIPTION: Quadruple FET Bus Switch; HEIGHT: 1.75mm; MANUFACTURER_NAME: Texas Instruments; MANUFACTURER_PART_NUMBER: SN74CBT3126D
IC9-IC11 = 74xx-eu:74*299: 8-bit universal SHIFT/STORAGE REGISTER
R1 = rcl:R-EU_: RESISTOR, European symbol; SPICEPREFIX: R
V1-V4 V8-V11 = 74ttl-din:74*283: 4-bit binary FULL ADDER, fast carry
V5-V7 = 74ttl-din:74*04: Hex INVERTER
V12-V15 V24-V27 = 74ttl-din:74*32: Quad 2-input OR gate
V16-V19 = 74ttl-din:74*08: Quad 2-input AND gate
V20-V23 = 74ttl-din:74*86: Quad 2-input EXCLUSIV-OR gate
V28 = 74ttl-din:74*238: 1 of 8 noninverting DECODER/DEMULTIPLEXER

## Board
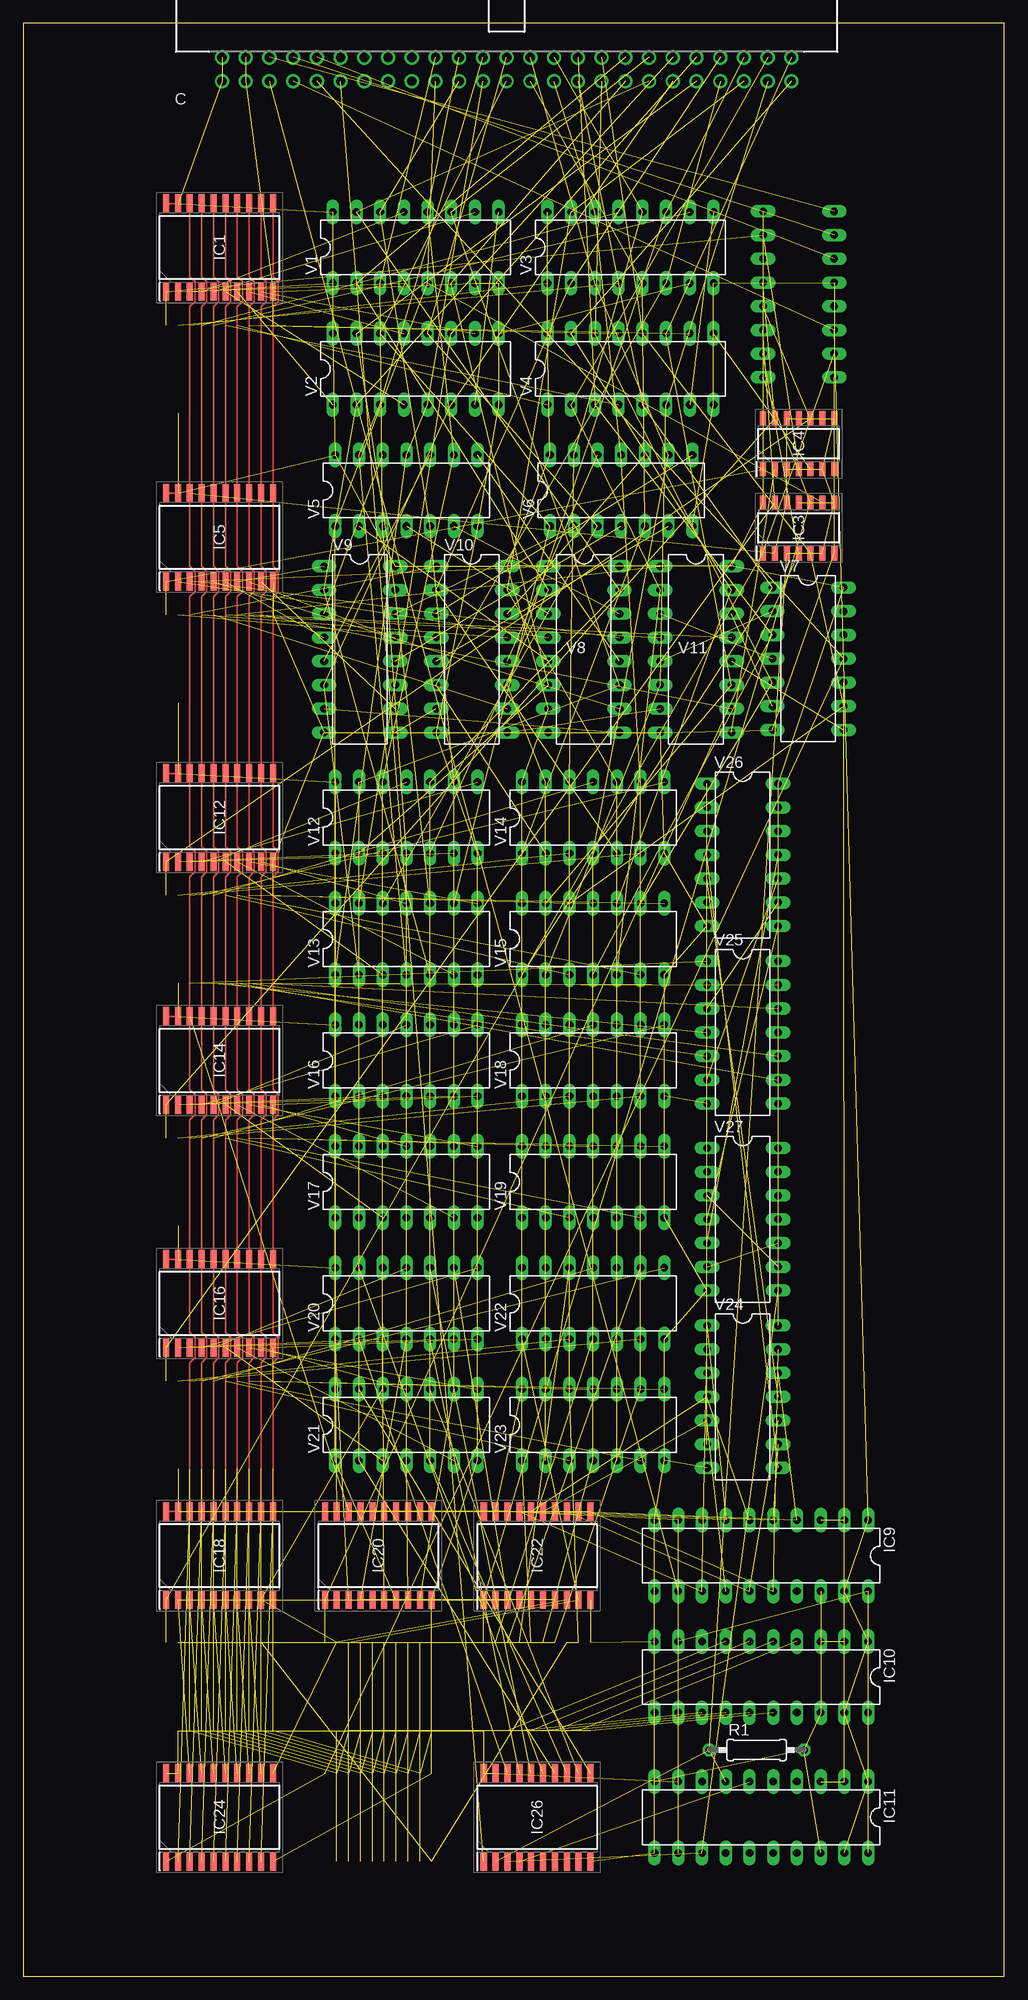
[diagram p7: board, top side]
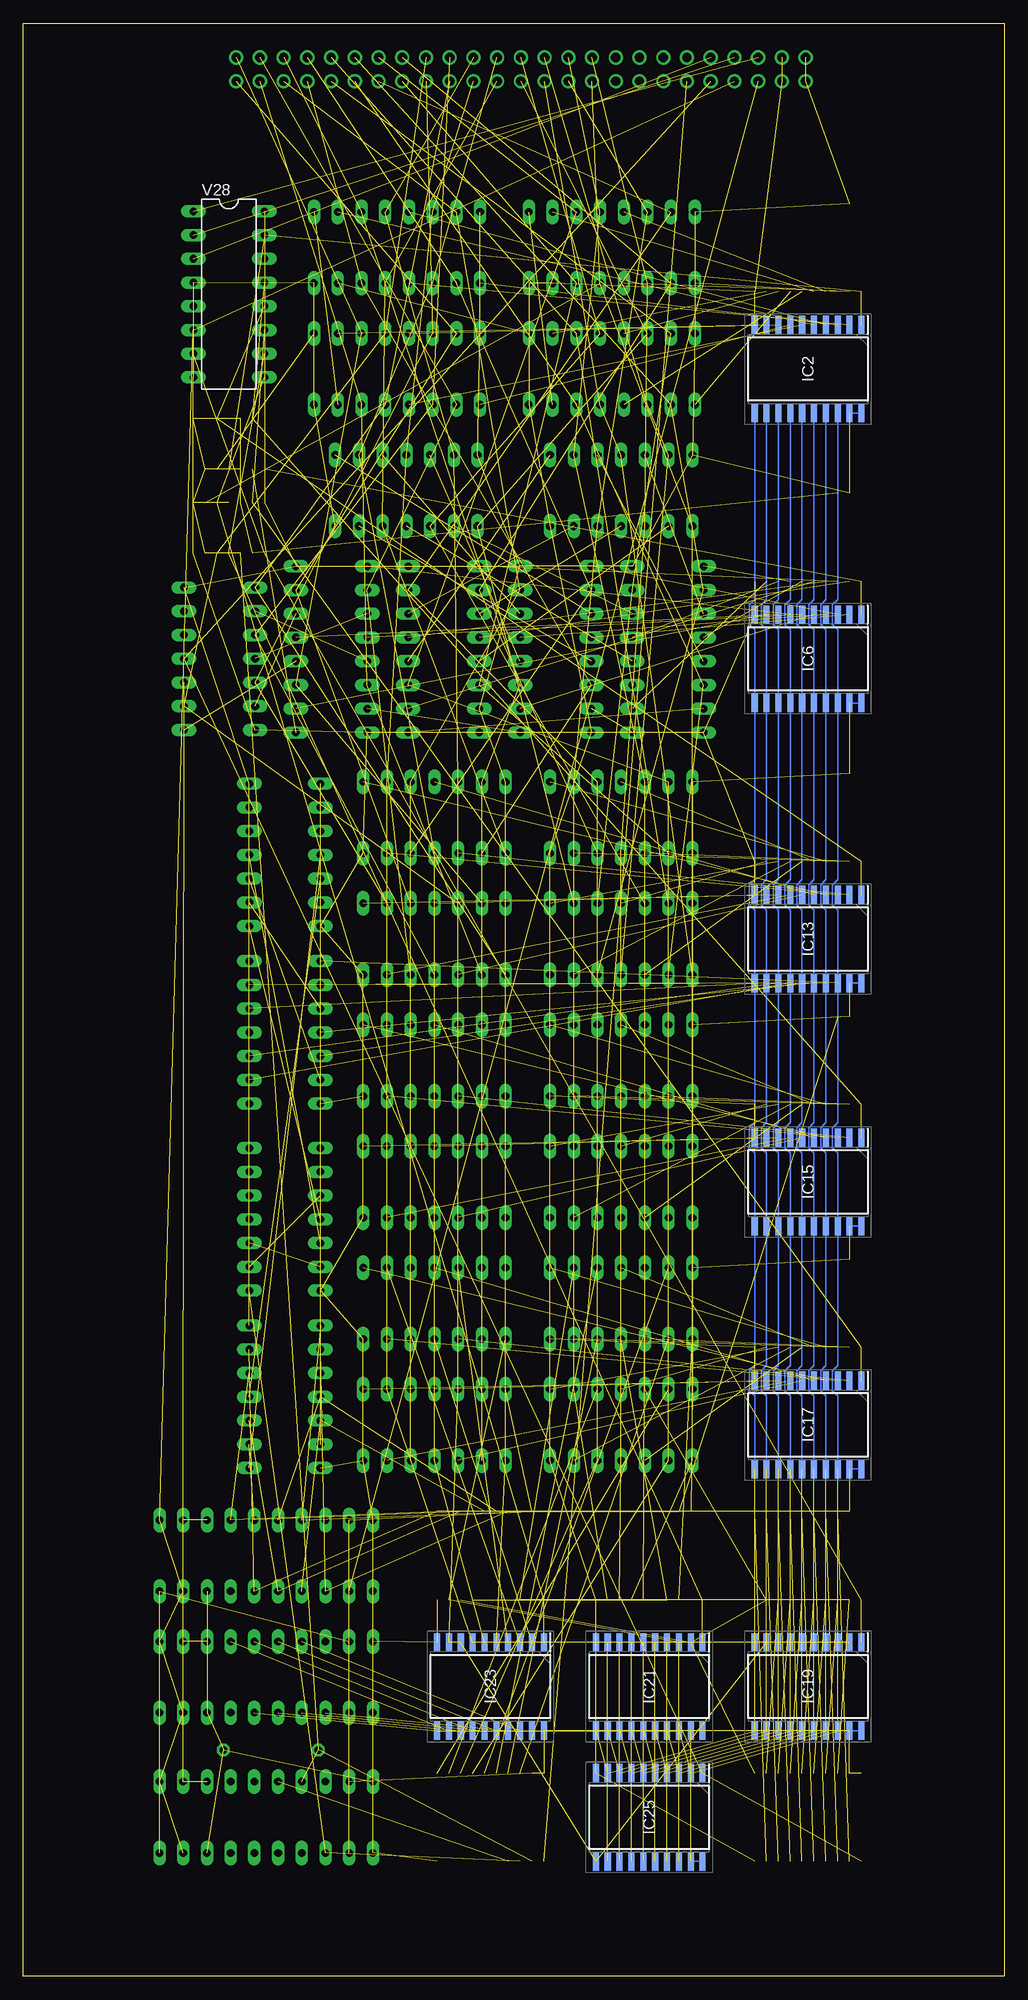
[diagram p8: board, bottom side, seen from below]

Size 105 x 209 mm. Coordinates in mm from the lower left corner, seen from the top.
Outline: 0,0 105,0 105,209 0,209 0,0
Copper layers (1*16): Top 0.035mm / dielectric 1.5mm / Bottom 0.035mm
Design rules "default": minimum track width 6mil, minimum drill 0.35mm, track to track 6mil, track to pad 6mil, pad to pad 6mil, via to via 6mil, smd to smd 6mil, copper to edge 40mil, drill to drill 6mil, minimum pad ring 10mil, minimum via ring 8mil, stop-mask expansion 4mil, vias tented up to drill 0mil, thermal gap 10mil

### Footprints (pad centres in the part's own frame; a part is rotated, then mirrored left to right if it is on the bottom)
PAK100/2500-5-50 = drill 1 pad 1.422: 1 -30.48,-1.27; 2 -30.48,1.27; 3 -27.94,-1.27; 4 -27.94,1.27; 5 -25.4,-1.27; 6 -25.4,1.27; 7 -22.86,-1.27; 8 -22.86,1.27; 9 -20.32,-1.27; 10 -20.32,1.27; 11 -17.78,-1.27; 12 -17.78,1.27; 13 -15.24,-1.27; 14 -15.24,1.27; 15 -12.7,-1.27; 16 -12.7,1.27; 17 -10.16,-1.27; 18 -10.16,1.27; 19 -7.62,-1.27; 20 -7.62,1.27; 21 -5.08,-1.27; 22 -5.08,1.27; 23 -2.54,-1.27; 24 -2.54,1.27; 25 0,-1.27; 26 0,1.27; 27 2.54,-1.27; 28 2.54,1.27; 29 5.08,-1.27; 30 5.08,1.27; 31 7.62,-1.27; 32 7.62,1.27; 33 10.16,-1.27; 34 10.16,1.27; 35 12.7,-1.27; 36 12.7,1.27; 37 15.24,-1.27; 38 15.24,1.27; 39 17.78,-1.27; 40 17.78,1.27; 41 20.32,-1.27; 42 20.32,1.27; 43 22.86,-1.27; 44 22.86,1.27; 45 25.4,-1.27; 46 25.4,1.27; 47 27.94,-1.27; 48 27.94,1.27; 49 30.48,-1.27; 50 30.48,1.27
SOIC127P1030X265-20N = smd 1.95 x 0.65: 1 -4.725,5.715; 2 -4.725,4.445; 3 -4.725,3.175; 4 -4.725,1.905; 5 -4.725,0.635; 6 -4.725,-0.635; 7 -4.725,-1.905; 8 -4.725,-3.175; 9 -4.725,-4.445; 10 -4.725,-5.715; 11 4.725,-5.715; 12 4.725,-4.445; 13 4.725,-3.175; 14 4.725,-1.905; 15 4.725,-0.635; 16 4.725,0.635; 17 4.725,1.905; 18 4.725,3.175; 19 4.725,4.445; 20 4.725,5.715
SOIC127P600X175-14N = smd 1.525 x 0.65: 1 -2.712,3.81; 2 -2.712,2.54; 3 -2.712,1.27; 4 -2.712,0; 5 -2.712,-1.27; 6 -2.712,-2.54; 7 -2.712,-3.81; 8 2.712,-3.81; 9 2.712,-2.54; 10 2.712,-1.27; 11 2.712,0; 12 2.712,1.27; 13 2.712,2.54; 14 2.712,3.81
DIL20 = drill 0.813 long: 1 -11.43,-3.81; 2 -8.89,-3.81; 3 -6.35,-3.81; 4 -3.81,-3.81; 5 -1.27,-3.81; 6 1.27,-3.81; 7 3.81,-3.81; 8 6.35,-3.81; 9 8.89,-3.81; 10 11.43,-3.81; 11 11.43,3.81; 12 8.89,3.81; 13 6.35,3.81; 14 3.81,3.81; 15 1.27,3.81; 16 -1.27,3.81; 17 -3.81,3.81; 18 -6.35,3.81; 19 -8.89,3.81; 20 -11.43,3.81
0207/10 = drill 0.813 octagon: 1 -5.08,0; 2 5.08,0
DIL16 = drill 0.813 long: 1 -8.89,-3.81; 2 -6.35,-3.81; 3 -3.81,-3.81; 4 -1.27,-3.81; 5 1.27,-3.81; 6 3.81,-3.81; 7 6.35,-3.81; 8 8.89,-3.81; 9 8.89,3.81; 10 6.35,3.81; 11 3.81,3.81; 12 1.27,3.81; 13 -1.27,3.81; 14 -3.81,3.81; 15 -6.35,3.81; 16 -8.89,3.81
DIL14 = drill 0.813 long: 1 -7.62,-3.81; 2 -5.08,-3.81; 3 -2.54,-3.81; 4 0,-3.81; 5 2.54,-3.81; 6 5.08,-3.81; 7 7.62,-3.81; 8 7.62,3.81; 9 5.08,3.81; 10 2.54,3.81; 11 0,3.81; 12 -2.54,3.81; 13 -5.08,3.81; 14 -7.62,3.81

### Placement (x,y rotation side)
C  51.74,204.08 0 top
IC1  21,185 90 top
IC2  21,172 270 bottom
IC3  83,155 90 top
IC4  83,164 90 top
IC5  21,154 90 top
IC6  21,141 270 bottom
IC9  79,45 180 top
IC10  79,32 180 top
IC11  79,17 180 top
IC12  21,124 90 top
IC13  21,111 270 bottom
IC14  21,98 90 top
IC15  21,85 270 bottom
IC16  21,72 90 top
IC17  21,59 270 bottom
IC18  21,45 90 top
IC19  21,31 270 bottom
IC20  38,45 90 top
IC21  38,31 270 bottom
IC22  55,45 90 top
IC23  55,31 270 bottom
IC24  21,17 90 top
IC25  38,17 270 bottom
IC26  55,17 90 top
R1  78.5,24.2 0 top
V1  42,185 0 top
V2  42,172 0 top
V3  65,185 0 top
V4  65,172 0 top
V5  41,159 0 top
V6  64,159 0 top
V7  84,141 270 top
V8  60,142 270 top
V9  36,142 270 top
V10  48,142 270 top
V11  72,142 270 top
V12  41,124 0 top
V13  41,111 0 top
V14  61,124 0 top
V15  61,111 0 top
V16  41,98 0 top
V17  41,85 0 top
V18  61,98 0 top
V19  61,85 0 top
V20  41,72 0 top
V21  41,59 0 top
V22  61,72 0 top
V23  61,59 0 top
V24  77,62 270 top
V25  77,101 270 top
V26  77,120 270 top
V27  77,81 270 top
V28  83,180 270 bottom

### Tracks (layer width: path | path; a pad name or v marks a point on that pad's centre or on a via)
BUSA_BIT0  (9 unrouted)
BUSA_BIT1  (9 unrouted)
BUSA_BIT2  (9 unrouted)
BUSA_BIT3  (9 unrouted)
BUSA_BIT4  (9 unrouted)
BUSA_BIT5  (9 unrouted)
BUSA_BIT6  (9 unrouted)
BUSA_BIT7  (9 unrouted)
BUSA_BIT8  (9 unrouted)
BUSA_BIT9  (9 unrouted)
BUSA_BIT10  (9 unrouted)
BUSA_BIT11  (9 unrouted)
BUSA_BIT12  (9 unrouted)
BUSA_BIT13  (9 unrouted)
BUSA_BIT14  (9 unrouted)
BUSA_BIT15  (10 unrouted)
BUSB_BIT0  (6 unrouted)
BUSB_BIT1  (6 unrouted)
BUSB_BIT2  (6 unrouted)
BUSB_BIT3  (6 unrouted)
BUSB_BIT4  (6 unrouted)
BUSB_BIT5  (6 unrouted)
BUSB_BIT6  (6 unrouted)
BUSB_BIT7  (6 unrouted)
BUSB_BIT8  (5 unrouted)
BUSB_BIT9  (5 unrouted)
BUSB_BIT10  (5 unrouted)
BUSB_BIT11  (5 unrouted)
BUSB_BIT12  (5 unrouted)
BUSB_BIT13  (5 unrouted)
BUSB_BIT14  (5 unrouted)
BUSB_BIT15  (5 unrouted)
BUSR_BIT0  (9 unrouted)
  Top 0.152: IC1.18 17.82,181.9 18.38,181.34 18.38,179.21 17.82,178.65 IC5.18 17.82,150.9 18.38,150.34 18.38,148.21 17.82,147.65 IC12.18 17.82,120.9 18.38,120.34 18.38,118.2 17.82,117.65 IC14.18 17.82,94.9 18.38,94.34 18.38,92.2 17.82,91.65 IC16.18 17.82,68.9 18.38,68.34 18.38,66.2 17.82,65.65 IC18.18
BUSR_BIT1  (5 unrouted)
  Top 0.152: IC1.17 19.09,181.9 19.65,181.34 19.65,179.21 19.09,178.65 IC5.17 19.09,150.9 19.65,150.34 19.65,148.21 19.09,147.65 IC12.17 19.09,120.9 19.65,120.34 19.65,118.2 19.09,117.65 IC14.17 19.09,94.9 19.65,94.34 19.65,92.2 19.09,91.65 IC16.17 19.09,68.9 19.65,68.34 19.65,66.2 19.09,65.65 IC18.17
BUSR_BIT2  (5 unrouted)
  Top 0.152: IC1.16 20.37,181.9 20.92,181.34 20.92,179.21 20.37,178.65 IC5.16 20.37,150.9 20.92,150.34 20.92,148.21 20.37,147.65 IC12.16 20.37,120.9 20.92,120.34 20.92,118.2 20.37,117.65 IC14.16 20.37,94.9 20.92,94.34 20.92,92.2 20.37,91.65 IC16.16 20.37,68.9 20.92,68.34 20.92,66.2 20.37,65.65 IC18.16
BUSR_BIT3  (5 unrouted)
  Top 0.152: IC1.15 21.63,181.9 22.19,181.34 22.19,179.21 21.63,178.65 IC5.15 21.63,150.9 22.19,150.34 22.19,148.21 21.63,147.65 IC12.15 21.63,120.9 22.19,120.34 22.19,118.2 21.63,117.65 IC14.15 21.63,94.9 22.19,94.34 22.19,92.2 21.63,91.65 IC16.15 21.63,68.9 22.19,68.34 22.19,66.2 21.63,65.65 IC18.15
BUSR_BIT4  (5 unrouted)
  Top 0.152: IC1.14 22.91,181.9 23.46,181.34 23.46,179.21 22.91,178.65 IC5.14 22.91,150.9 23.46,150.34 23.46,148.21 22.91,147.65 IC12.14 22.91,120.9 23.46,120.34 23.46,118.2 22.91,117.65 IC14.14 22.91,94.9 23.46,94.34 23.46,92.2 22.91,91.65 IC16.14 22.91,68.9 23.46,68.34 23.46,66.2 22.91,65.65 IC18.14
BUSR_BIT5  (5 unrouted)
  Top 0.152: IC1.13 24.18,181.9 24.73,181.34 24.73,179.21 24.18,178.65 IC5.13 24.18,150.9 24.73,150.34 24.73,148.21 24.18,147.65 IC12.13 24.18,120.9 24.73,120.34 24.73,118.2 24.18,117.65 IC14.13 24.18,94.9 24.73,94.34 24.73,92.2 24.18,91.65 IC16.13 24.18,68.9 24.73,68.34 24.73,66.2 24.18,65.65 IC18.13
BUSR_BIT6  (5 unrouted)
  Top 0.152: IC1.12 25.45,181.9 26,181.34 26,179.21 25.45,178.65 IC5.12 25.45,150.9 26,150.34 26,148.21 25.45,147.65 IC12.12 25.45,120.9 26,120.34 26,118.2 25.45,117.65 IC14.12 25.45,94.9 26,94.34 26,92.2 25.45,91.65 IC16.12 25.45,68.9 26,68.34 26,66.2 25.45,65.65 IC18.12
BUSR_BIT7  (5 unrouted)
  Top 0.152: IC1.11 26.71,181.9 27.27,181.34 27.27,179.21 26.71,178.65 IC5.11 26.71,150.9 27.27,150.34 27.27,148.21 26.71,147.65 IC12.11 26.71,120.9 27.27,120.34 27.27,118.2 26.71,117.65 IC14.11 26.71,94.9 27.27,94.34 27.27,92.2 26.71,91.65 IC16.11 26.71,68.9 27.27,68.34 27.27,66.2 26.71,65.65 IC18.11
BUSR_BIT8  (6 unrouted)
  Bottom 0.152: IC2.18 17.82,147.35 18.38,146.79 18.38,144.66 17.82,144.1 IC6.18 17.82,117.35 18.38,116.8 18.38,114.66 17.82,114.1 IC13.18 17.82,91.35 18.38,90.8 18.38,88.66 17.82,88.1 IC15.18 17.82,65.35 18.38,64.8 18.38,62.66 17.82,62.1 IC17.18
BUSR_BIT9  (6 unrouted)
  Bottom 0.152: IC2.17 19.09,147.35 19.65,146.79 19.65,144.66 19.09,144.1 IC6.17 19.09,117.35 19.65,116.8 19.65,114.66 19.09,114.1 IC13.17 19.09,91.35 19.65,90.8 19.65,88.66 19.09,88.1 IC15.17 19.09,65.35 19.65,64.8 19.65,62.66 19.09,62.1 IC17.17
BUSR_BIT10  (6 unrouted)
  Bottom 0.152: IC2.16 20.37,147.35 20.92,146.79 20.92,144.66 20.37,144.1 IC6.16 20.37,117.35 20.92,116.8 20.92,114.66 20.37,114.1 IC13.16 20.37,91.35 20.92,90.8 20.92,88.66 20.37,88.1 IC15.16 20.37,65.35 20.92,64.8 20.92,62.66 20.37,62.1 IC17.16
BUSR_BIT11  (6 unrouted)
  Bottom 0.152: IC2.15 21.63,147.35 22.19,146.79 22.19,144.66 21.63,144.1 IC6.15 21.63,117.35 22.19,116.8 22.19,114.66 21.63,114.1 IC13.15 21.63,91.35 22.19,90.8 22.19,88.66 21.63,88.1 IC15.15 21.63,65.35 22.19,64.8 22.19,62.66 21.63,62.1 IC17.15
BUSR_BIT12  (6 unrouted)
  Bottom 0.152: IC2.14 22.91,147.35 23.46,146.79 23.46,144.66 22.91,144.1 IC6.14 22.91,117.35 23.46,116.8 23.46,114.66 22.91,114.1 IC13.14 22.91,91.35 23.46,90.8 23.46,88.66 22.91,88.1 IC15.14 22.91,65.35 23.46,64.8 23.46,62.66 22.91,62.1 IC17.14
BUSR_BIT13  (6 unrouted)
  Bottom 0.152: IC2.13 24.18,147.35 24.73,146.79 24.73,144.66 24.18,144.1 IC6.13 24.18,117.35 24.73,116.8 24.73,114.66 24.18,114.1 IC13.13 24.18,91.35 24.73,90.8 24.73,88.66 24.18,88.1 IC15.13 24.18,65.35 24.73,64.8 24.73,62.66 24.18,62.1 IC17.13
BUSR_BIT14  (6 unrouted)
  Bottom 0.152: IC2.12 25.45,147.35 26,146.79 26,144.66 25.45,144.1 IC6.12 25.45,117.35 26,116.8 26,114.66 25.45,114.1 IC13.12 25.45,91.35 26,90.8 26,88.66 25.45,88.1 IC15.12 25.45,65.35 26,64.8 26,62.66 25.45,62.1 IC17.12
BUSR_BIT15  (6 unrouted)
  Bottom 0.152: IC2.11 26.71,147.35 27.27,146.79 27.27,144.66 26.71,144.1 IC6.11 26.71,117.35 27.27,116.8 27.27,114.66 26.71,114.1 IC13.11 26.71,91.35 27.27,90.8 27.27,88.66 26.71,88.1 IC15.11 26.71,65.35 27.27,64.8 27.27,62.66 26.71,62.1 IC17.11
BUSR_FLAG_CARRY  (10 unrouted)
BUSR_FLAG_NONZERO  (2 unrouted)
BUSR_FLAG_SIGN  (1 unrouted)
CLOCK  (3 unrouted)
GND  (64 unrouted)
INPUT_EN  (7 unrouted)
MODE_ADD  (3 unrouted)
MODE_AND  (3 unrouted)
MODE_BIT0  (1 unrouted)
MODE_BIT1  (1 unrouted)
MODE_BIT2  (1 unrouted)
MODE_LSFT  (3 unrouted)
MODE_OR  (3 unrouted)
MODE_RSFT  (3 unrouted)
MODE_SUB  (3 unrouted)
MODE_TEST  (3 unrouted)
MODE_XOR  (3 unrouted)
N$1  (1 unrouted)
N$2  (1 unrouted)
N$3  (1 unrouted)
N$4  (1 unrouted)
N$5  (1 unrouted)
N$6  (1 unrouted)
N$7  (1 unrouted)
N$8  (1 unrouted)
N$9  (1 unrouted)
N$10  (1 unrouted)
N$11  (1 unrouted)
N$12  (1 unrouted)
N$13  (1 unrouted)
N$14  (1 unrouted)
N$15  (1 unrouted)
N$16  (1 unrouted)
N$17  (1 unrouted)
N$18  (1 unrouted)
N$19  (1 unrouted)
N$20  (1 unrouted)
N$21  (1 unrouted)
N$22  (1 unrouted)
N$23  (1 unrouted)
N$24  (1 unrouted)
N$25  (1 unrouted)
N$26  (1 unrouted)
N$27  (1 unrouted)
N$28  (1 unrouted)
N$29  (1 unrouted)
N$30  (1 unrouted)
N$31  (1 unrouted)
N$32  (1 unrouted)
N$33  (1 unrouted)
N$34  (1 unrouted)
N$35  (1 unrouted)
N$36  (1 unrouted)
N$37  (1 unrouted)
N$38  (1 unrouted)
N$39  (1 unrouted)
N$40  (1 unrouted)
N$41  (1 unrouted)
N$42  (1 unrouted)
N$43  (1 unrouted)
N$44  (1 unrouted)
N$45  (1 unrouted)
N$46  (1 unrouted)
N$47  (1 unrouted)
N$48  (1 unrouted)
N$49  (1 unrouted)
N$50  (1 unrouted)
N$51  (1 unrouted)
N$52  (1 unrouted)
N$53  (1 unrouted)
N$54  (1 unrouted)
N$55  (1 unrouted)
N$56  (1 unrouted)
N$57  (1 unrouted)
N$58  (1 unrouted)
N$66  (1 unrouted)
N$67  (1 unrouted)
N$68  (1 unrouted)
N$70  (6 unrouted)
N$72  (1 unrouted)
N$74  (1 unrouted)
N$75  (1 unrouted)
N$77  (1 unrouted)
N$78  (1 unrouted)
N$79  (1 unrouted)
N$80  (1 unrouted)
N$81  (1 unrouted)
N$82  (1 unrouted)
N$83  (1 unrouted)
N$84  (1 unrouted)
N$85  (1 unrouted)
N$86  (1 unrouted)
N$87  (1 unrouted)
N$88  (1 unrouted)
N$89  (1 unrouted)
N$90  (1 unrouted)
N$91  (1 unrouted)
N$92  (1 unrouted)
N$93  (1 unrouted)
N$94  (1 unrouted)
N$95  (1 unrouted)
N$96  (1 unrouted)
N$97  (1 unrouted)
N$98  (1 unrouted)
N$99  (1 unrouted)
N$100  (1 unrouted)
N$101  (1 unrouted)
N$102  (1 unrouted)
N$103  (1 unrouted)
N$104  (1 unrouted)
N$105  (1 unrouted)
N$106  (1 unrouted)
N$107  (1 unrouted)
N$108  (1 unrouted)
N$109  (1 unrouted)
N$110  (1 unrouted)
N$111  (1 unrouted)
N$112  (1 unrouted)
N$113  (1 unrouted)
N$114  (1 unrouted)
N$115  (1 unrouted)
N$116  (1 unrouted)
N$117  (1 unrouted)
N$118  (1 unrouted)
N$119  (1 unrouted)
N$120  (1 unrouted)
N$121  (1 unrouted)
N$122  (1 unrouted)
N$123  (1 unrouted)
N$124  (1 unrouted)
N$125  (1 unrouted)
N$126  (1 unrouted)
N$127  (1 unrouted)
N$128  (1 unrouted)
N$129  (1 unrouted)
N$130  (1 unrouted)
OUTPUT_DATA_EN  (3 unrouted)
OUTPUT_FLAGS_EN  (1 unrouted)
VCC  (63 unrouted)
  Top 0.152: IC5.20 IC5.19 | IC1.20 IC1.19 | IC12.20 IC12.19 | IC14.20 IC14.19 | IC16.19 IC16.20 | IC18.19 IC18.20
  Bottom 0.152: IC2.20 IC2.19 | IC6.20 IC6.19 | IC13.20 IC13.19 | IC15.20 IC15.19 | IC17.20 IC17.19 | IC25.19 IC25.20 | IC19.20 IC19.19